# EAGLE design ina199-current-sensor (EAGLE 7.7.0)
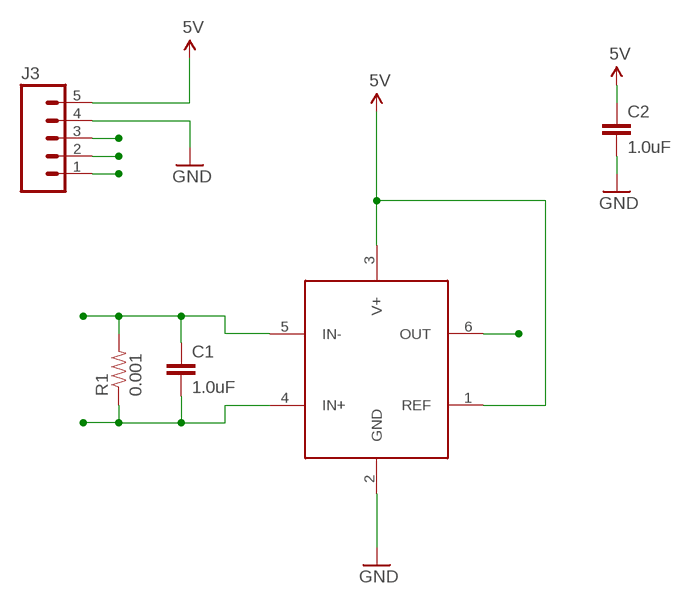
[diagram p0: schematic, sheet 1]

## Parts
C1  1.0uF  1.0UF50V10%(1206)  [1206-CAP]
C2  1.0uF  1.0UF50V10%(1206)  [1206-CAP]
J3  M05LOCK_LONGPADS  [1X05_LOCK_LONGPADS]
R1  0.001  0.001OHM-3W-1%(2512)3W/1%  [2512]
U$1  INA199SC70  [SC70-6]

## Nets
5V: C2.1 J3.5 U$1.1(REF) U$1.3(V+)
GND: C2.2 J3.4 U$1.2(GND)
LOAD: C1.1 J3.2 R1.2 U$1.5(IN-)
OUT: J3.3 U$1.6(OUT)
SUPPLY: C1.2 J3.1 R1.1 U$1.4(IN+)

## Library data of the parts
C1 C2 = SparkFun-Capacitors:1.0UF50V10%(1206): CAP-09822; PROD_ID: CAP-09822
J3 = SparkFun-Connectors:M05: Header 5 Standard 5-pin 0.1" header. Use with straight break away headers (SKU : PRT-00116), right angle break away headers (PRT-00553), swiss pins (PRT-00743), machine pins (PRT-00117), and female headers (PRT-00115). Molex polarized connector foot print use with SKU : PRT-08230 with associated crimp pins and housings.
R1 = SparkFun-Resistors:0.001OHM-3W-1%(2512); PROD_ID: RES-12449
U$1 = Synapseware:INA199: INA199-Q1 Automotive, 26-V, Bidirectional, Zero-Drift, Low- or High-Side, Voltage-Output, Current-Shunt Monitor

## Board
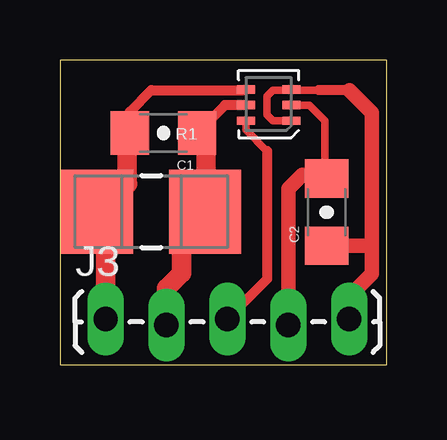
[diagram p1: board, top side]

Size 13.64 x 12.69 mm. Coordinates in mm from the lower left corner, seen from the top.
Outline: 0,0 13.64,0 13.64,12.69 0,12.69 0,0
Copper layers (1*16): Top 0.035mm / dielectric 1.5mm / Bottom 0.035mm
Design rules "default": minimum track width 10mil, minimum drill 24mil, track to track 8mil, track to pad 8mil, pad to pad 8mil, via to via 8mil, smd to smd 8mil, copper to edge 40mil, drill to drill 8mil, minimum pad ring 10mil, minimum via ring 8mil, stop-mask expansion 4mil, vias tented up to drill 0mil, thermal gap 10mil

### Footprints (pad centres in the part's own frame; a part is rotated, then mirrored left to right if it is on the bottom)
1206-CAP = smd 1.6 x 1.8: 1 -1.4,0; 2 1.4,0
1X05_LOCK_LONGPADS = drill 1.016 long: 1 0,0; 2 2.54,-0.254; 3 5.08,0; 4 7.62,-0.254; 5 10.16,0
2512 = smd 3 x 3.5: 1 -2.25,0; 2 2.25,0
SC70-6 = smd 0.35 x 0.75: 1 0,0; 2 0.65,0; 3 1.3,0; 4 1.3,1.9; 5 0.65,1.9; 6 0,1.9

### Placement (x,y rotation side)
C1  4.32,9.65 180 top
C2  11.13,6.35 90 top
J3  1.91,1.91 0 top
R1  3.81,6.38 0 top
U$1  9.65,10.16 90 top

### Tracks (layer width: path | path; a pad name or v marks a point on that pad's centre or on a via)
5V
  Top 0.305: U$1.1 8.89,10.16 8.64,10.41 8.64,11.18 8.89,11.43 9.62,11.43 U$1.3 9.68,11.43 10.79,11.43
  Top 0.406: 12.06,11.43 10.79,11.43
  Top 0.61: J3.5 12.06,2.85 13.01,3.79 13.01,4.95 | 13.01,4.95 13.01,10.49 12.06,11.43 | C2.1 13.01,4.95
GND
  Top 0.305: U$1.2 10.4,10.81 11.05,10.16 11.05,7.7 C2.2
  Top 0.61: J3.4 9.53,7.32 10.11,7.9 11.28,7.9 C2.2
LOAD
  Top 0.406: U$1.5 6.88,10.81 C1.1
  Top 0.813: C1.1 6.1,9.65 6.1,7.11 5.81,7.53 R1.2 5.08,6.13 5.08,3.81 4.45,3.17 J3.2
OUT
  Top 0.305: U$1.6 7.75,9.77 8.64,8.89
  Top 0.406: 8.64,8.89 8.64,3.56 J3.3
SUPPLY
  Top 0.406: C1.2 2.92,10.54 3.81,11.43 7.72,11.43 U$1.4
  Top 0.813: C1.2 2.79,9.65 2.79,7.53 2.83,7.53 R1.1 1.91,6.19 J3.1